# EAGLE design motor-control (EAGLE 6.2)
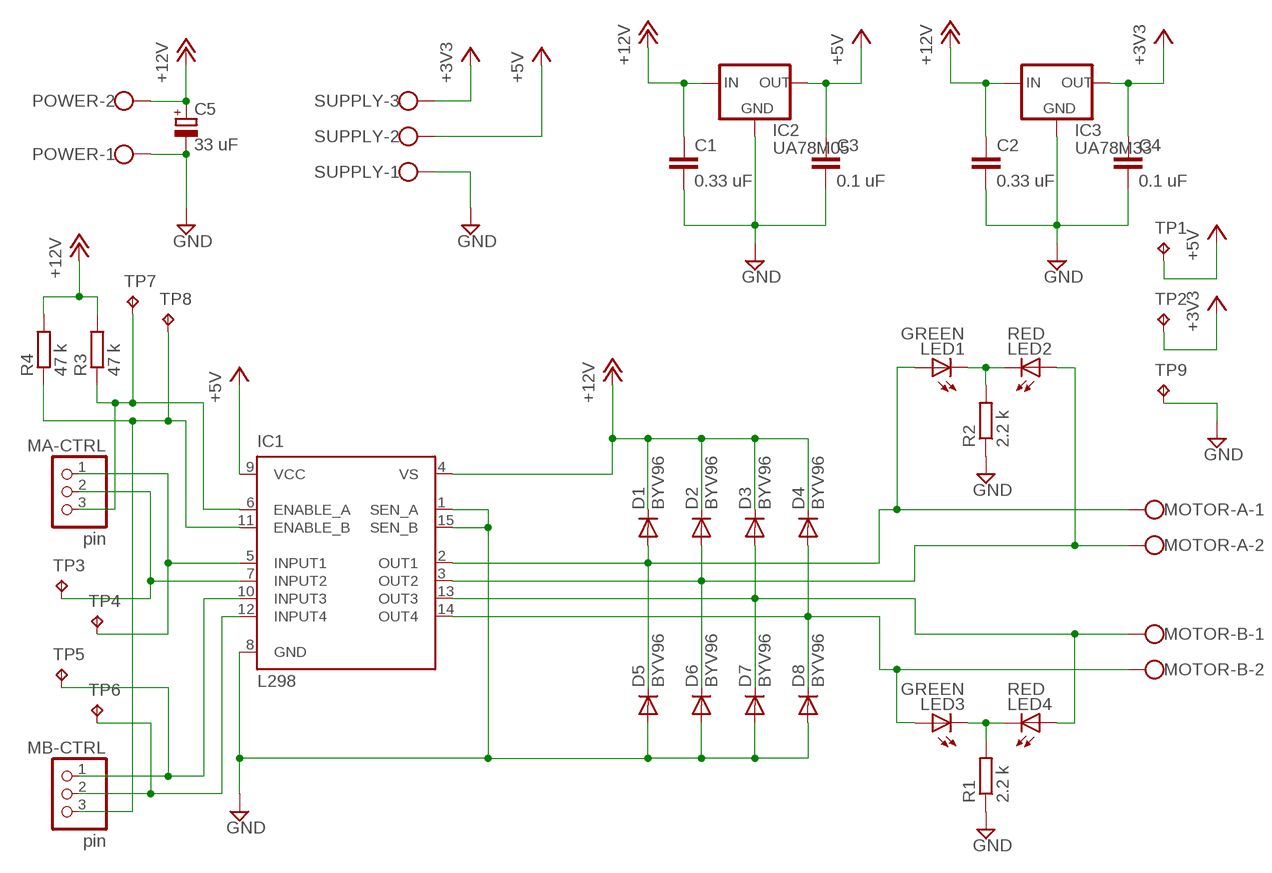
[diagram p0: schematic, sheet 1]

## Parts
C1  0.33 uF  C-EU050-024X044  [C050-024X044]
C2  0.33 uF  C-EU050-024X044  [C050-024X044]
C3  0.1 uF  C-EU050-024X044  [C050-024X044]
C4  0.1 uF  C-EU050-024X044  [C050-024X044]
C5  33 uF  CPOL-EUE2.5-5  [E2,5-5]
D1  BYV96  [SOD57-10]
D2  BYV96  [SOD57-10]
D3  BYV96  [SOD57-10]
D4  BYV96  [SOD57-10]
D5  BYV96  [SOD57-10]
D6  BYV96  [SOD57-10]
D7  BYV96  [SOD57-10]
D8  BYV96  [SOD57-10]
IC1  L298  [MULTIWATT-15]
IC2  UA78M05  78XXS  [78XXS]
IC3  UA78M33  78XXS  [78XXS]
LED1  GREEN  LED5MM  [LED5MM]
LED2  RED  LED5MM  [LED5MM]
LED3  GREEN  LED5MM  [LED5MM]
LED4  RED  LED5MM  [LED5MM]
MA-CTRL  pin  PINHD-1X3  [1X03]
MB-CTRL  pin  PINHD-1X3  [1X03]
MOTOR-A  W237-02P  [W237-132]
MOTOR-B  W237-02P  [W237-132]
POWER  W237-02P  [W237-132]
R1  2.2 k  R-EU_0207/7  [0207/7]
R2  2.2 k  R-EU_0207/7  [0207/7]
R3  47 k  R-EU_0207/7  [0207/7]
R4  47 k  R-EU_0207/7  [0207/7]
SUPPLY  W237-03P  [W237-133]
TP1  TPTP14SQ  [TP14SQ]
TP2  TPTP14SQ  [TP14SQ]
TP3  TPTP14SQ  [TP14SQ]
TP4  TPTP14SQ  [TP14SQ]
TP5  TPTP14SQ  [TP14SQ]
TP6  TPTP14SQ  [TP14SQ]
TP7  TPTP14SQ  [TP14SQ]
TP8  TPTP14SQ  [TP14SQ]
TP9  TPTP14SQ  [TP14SQ]

## Nets
+3V3: C4.1 IC3.OUT SUPPLY.3 TP2.TP
+5V: C3.1 IC1.9(VCC) IC2.OUT SUPPLY.2 TP1.TP
+12V: C1.1 C2.1 C5.+ D1.C D2.C D3.C D4.C IC1.4(VS) IC2.IN IC3.IN POWER.2 R3.2 R4.2
GND: C1.2 C2.2 C3.2 C4.2 C5.- D5.A D6.A D7.A D8.A IC1.1(SEN_A) IC1.8(GND) IC1.15(SEN_B) IC2.GND IC3.GND POWER.1 R1.1 R2.1 SUPPLY.1 TP9.TP
N$1: D1.A D5.C IC1.2(OUT1) LED1.A MOTOR-A.1
N$2: LED3.K(C) LED4.K(C) R1.2
N$3: LED1.K(C) LED2.K(C) R2.2
N$4: IC1.10(INPUT3) MB-CTRL.1 TP5.TP
N$5: IC1.12(INPUT4) MB-CTRL.2 TP6.TP
N$8: D4.A D8.C IC1.14(OUT4) LED3.A MOTOR-B.2
N$10: IC1.5(INPUT1) MA-CTRL.1 TP4.TP
N$11: IC1.7(INPUT2) MA-CTRL.2 TP3.TP
N$12: IC1.6(ENABLE_A) MA-CTRL.3 R3.1 TP7.TP
N$13: IC1.11(ENABLE_B) MB-CTRL.3 R4.1 TP8.TP
N$14: D2.A D6.C IC1.3(OUT2) LED2.A MOTOR-A.2
N$15: D3.A D7.C IC1.13(OUT3) LED4.A MOTOR-B.1

## Library data of the parts
C1-C4 = rcl:C-EU: CAPACITOR, European symbol
C5 = resistor:CPOL-EU: POLARIZED CAPACITOR, European symbol
D1-D8 = diode:BYV96: DIODE fast soft-recovery controlled avalanche rectifier
IC1 = st-microelectronics:L298: DUAL FULL-BRIDGE DRIVER
IC2 IC3 = v-reg:78XXS: VOLTAGE REGULATOR
LED1-LED4 = led:LED: LED OSRAM: - CHIPLED LG R971, LG N971, LY N971, LG Q971, LY Q971, LO R971, LY R971 LH N974, LH R974 LS Q976, LO Q976, LY Q976 LO Q996 - Hyper CHIPLED LW Q18S LB Q993, LB Q99A, LB R99A - SideLED LS A670, LO A670, LY A670, LG A670, LP A670 LB A673, LV A673, LT A673, LW A673 LH A674 LY A675 LS A676, LA A676, LO A676, LY A676, LW A676 LS A679, LY A679, LG A679 - Hyper Micro SIDELED® LS Y876, LA Y876, LO Y876, LY Y876 LT Y87S - SmartLED LW L88C, LW L88S LB L89C, LB L89S, LG L890 LS L89K, LO L89K, LY L89K LS L896, LA L896, LO L896, LY L896 - TOPLED LS T670, LO T670, LY T670, LG T670, LP T670 LSG T670, LSP T670, LSY T670, LOP T670, LYG T670 LG T671, LOG T671, LSG T671 LB T673, LV T673, LT T673, LW T673 LH T674 LS T676, LA T676, LO T676, LY T676, LB T676, LH T676, LSB T676, LW T676 LB T67C, LV T67C, LT T67C, LS T67K, LO T67K, LY T67K, LW E67C LS E67B, LA E67B, LO E67B, LY E67B, LB E67C, LV E67C, LT E67C LW T67C LS T679, LY T679, LG T679 LS T770, LO T770, LY T770, LG T770, LP T770 LB T773, LV T773, LT T773, LW T773 LH T774 LS E675, LA E675, LY E675, LS T675 LS T776, LA T776, LO T776, LY T776, LB T776 LHGB T686 LT T68C, LB T68C - Hyper Mini TOPLED® LB M676 - Mini TOPLED Santana® LG M470 LS M47K, LO M47K, LY M47K Source: http://www.osram.convergy.de LUXEON: - LUMILED® LXK2-PW12-R00, LXK2-PW12-S00, LXK2-PW14-U00, LXK2-PW14-V00 LXK2-PM12-R00, LXK2-PM12-S00, LXK2-PM14-U00 LXK2-PE12-Q00, LXK2-PE12-R00, LXK2-PE12-S00, LXK2-PE14-T00, LXK2-PE14-U00 LXK2-PB12-K00, LXK2-PB12-L00, LXK2-PB12-M00, LXK2-PB14-N00, LXK2-PB14-P00, LXK2-PB14-Q00 LXK2-PR12-L00, LXK2-PR12-M00, LXK2-PR14-Q00, LXK2-PR14-R00 LXK2-PD12-Q00, LXK2-PD12-R00, LXK2-PD12-S00 LXK2-PH12-R00, LXK2-PH12-S00 LXK2-PL12-P00, LXK2-PL12-Q00, LXK2-PL12-R00 Source: www.luxeon.com KINGBRIGHT: KA-3528ASYC Source: www.kingbright.com
MA-CTRL MB-CTRL = pinhead:PINHD-1X3: PIN HEADER
MOTOR-A MOTOR-B POWER = con-wago-508:W237-02P: WAGO SREW CLAMP
R1-R4 = resistor:R-EU_: RESISTOR, European symbol
SUPPLY = con-wago-508:W237-03P: WAGO SREW CLAMP
TP1-TP9 = testpad:TP: Test pad

## Board
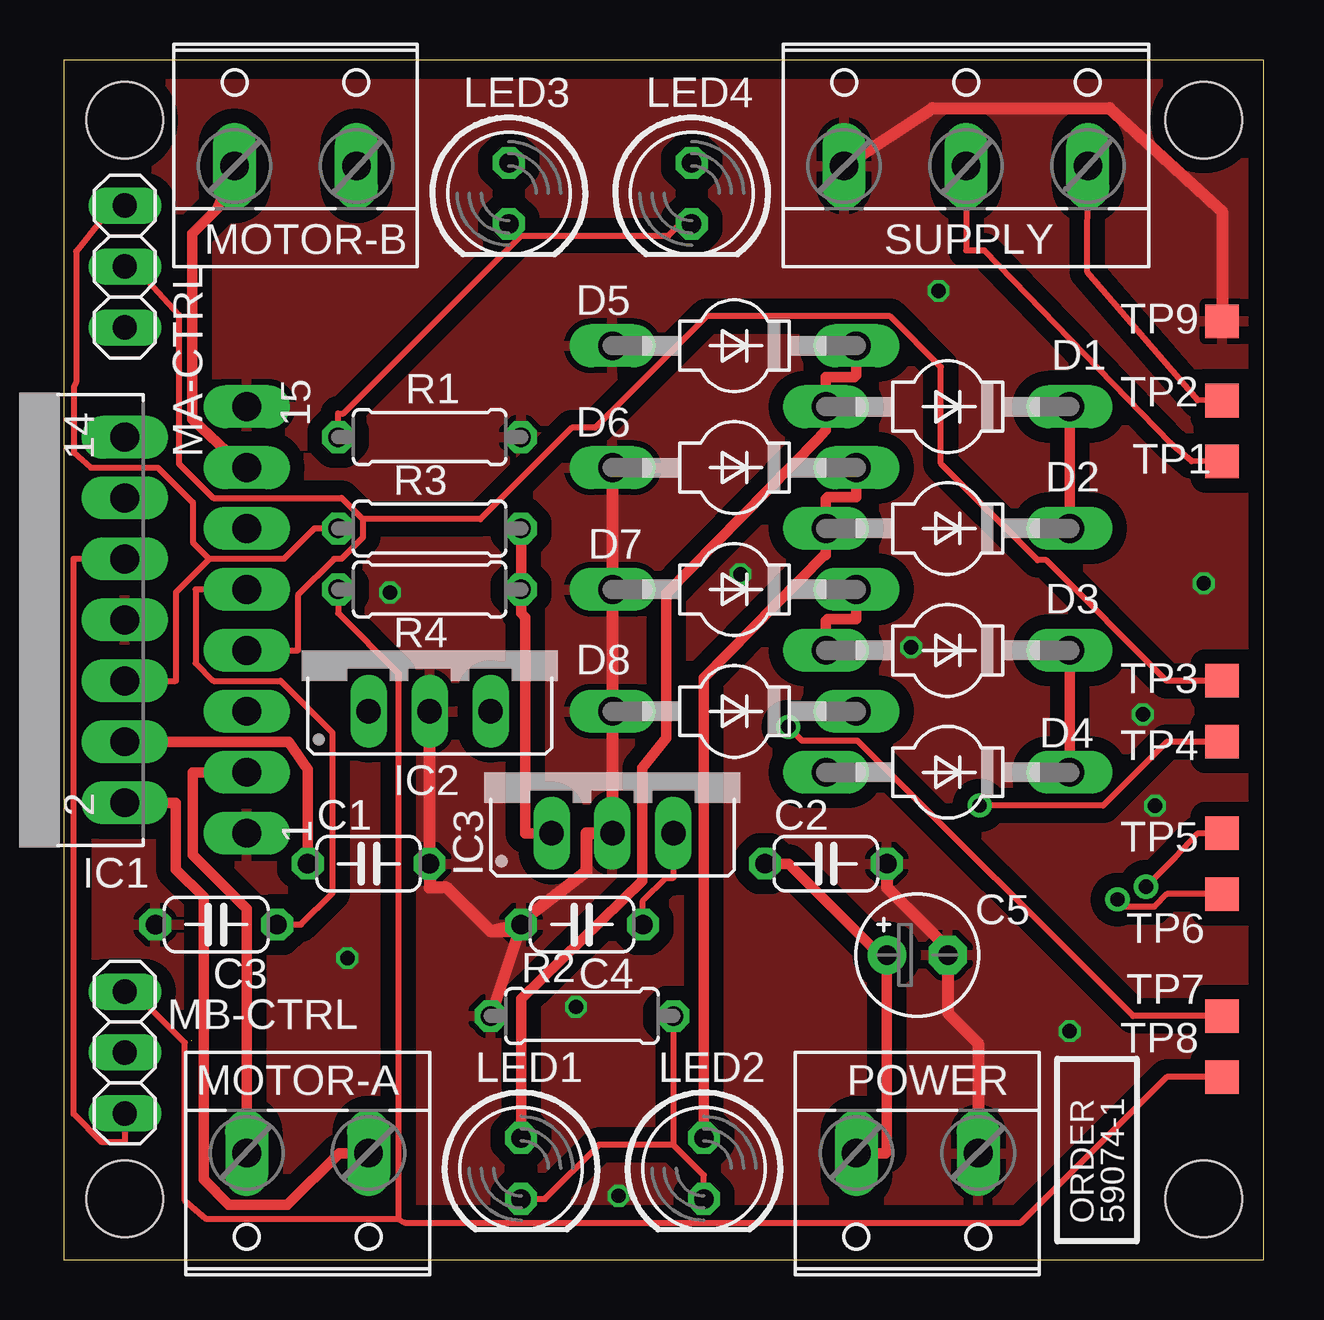
[diagram p1: board, top side]
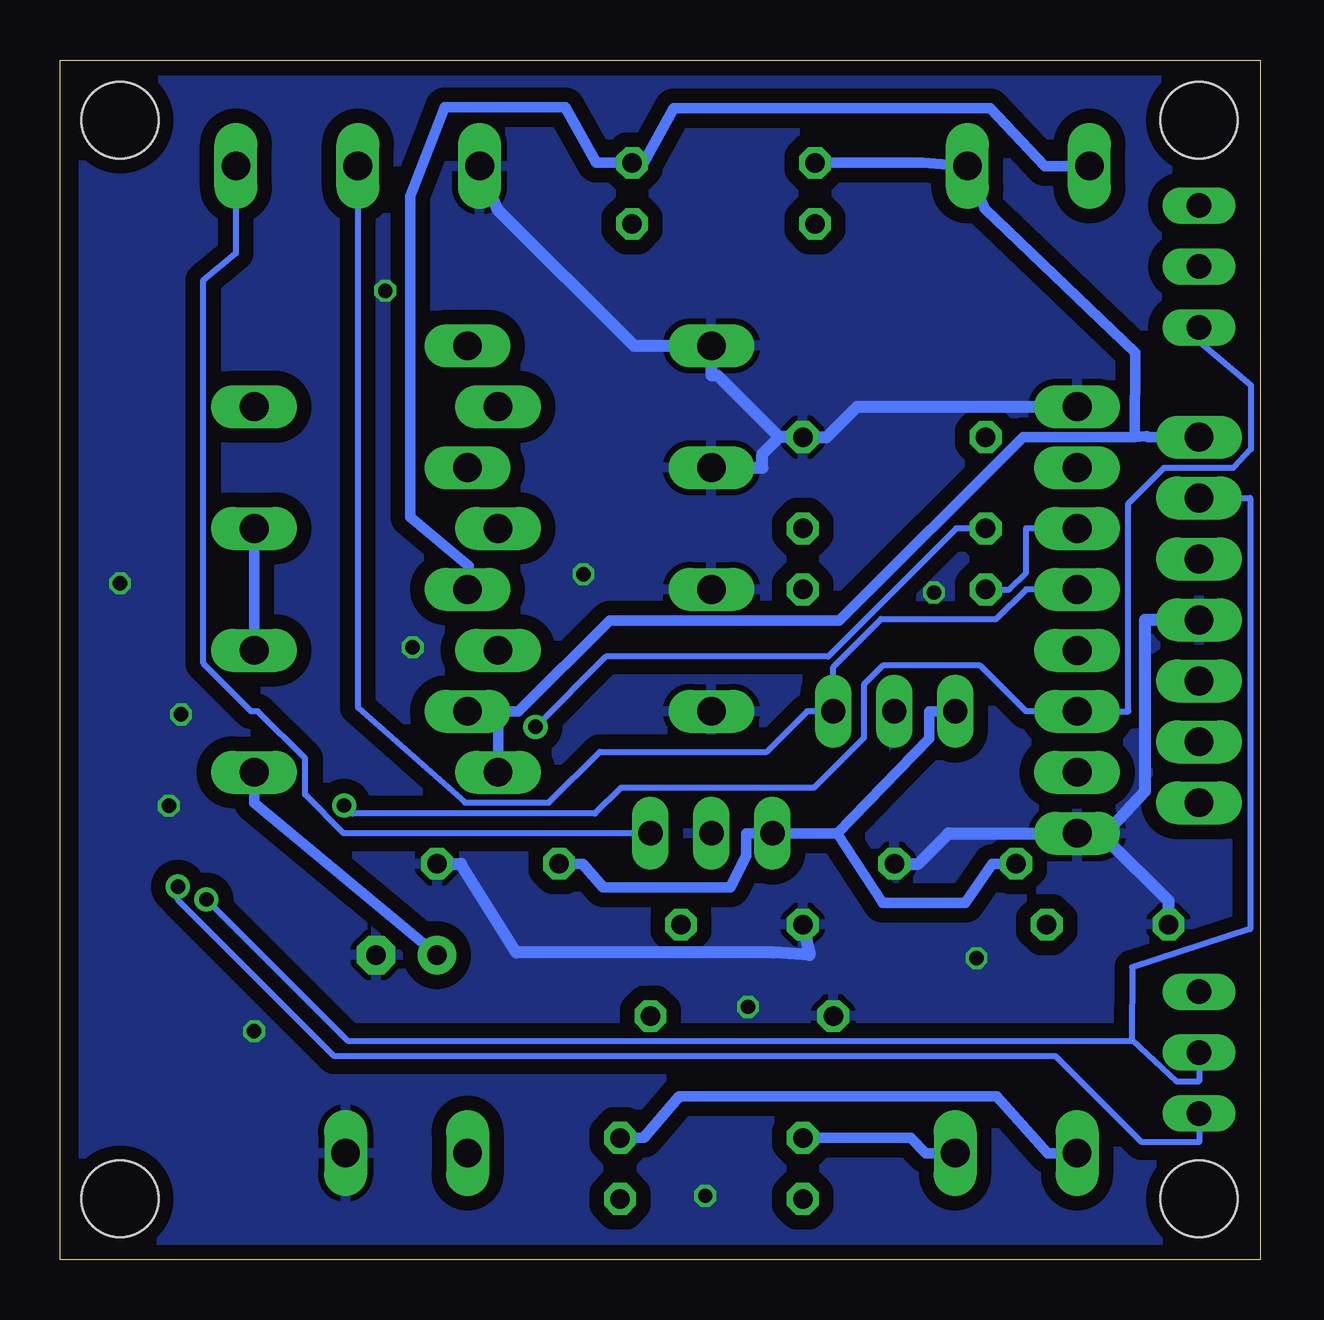
[diagram p2: board, bottom side, seen from below]

Size 50 x 50.01 mm. Coordinates in mm from the lower left corner, seen from the top.
Outline: 0,0 50,0 50,50.01 0,50.01 0,0
Copper layers (1*16): Top 0.035mm / dielectric 1.5mm / Bottom 0.035mm
Design rules: minimum track width 6mil, minimum drill 12mil, track to track 6mil, track to pad 6mil, pad to pad 6mil, via to via 6mil, smd to smd 0mil, copper to edge 10mil, drill to drill 10mil, minimum pad ring 10mil, minimum via ring 6mil, stop-mask expansion 2mil, vias tented up to drill 100mil, thermal gap 10mil
Holes 3.2 mm at 2.54,47.5 2.54,2.54 47.5,47.5 47.5,2.54

### Footprints (pad centres in the part's own frame; a part is rotated, then mirrored left to right if it is on the bottom)
C050-024X044 = drill 0.813 octagon: 1 -2.54,0; 2 2.54,0
E2,5-5 = drill 0.813 pad 1.6: + -1.27,0 | drill 0.813 pad 1.6 octagon: - 1.27,0
SOD57-10 = drill 1.194 long: A 5.08,0; C -5.08,0
MULTIWATT-15 = drill 1.2 long: 1 -8.89,-7.62; 2 -7.62,-2.54; 3 -6.35,-7.62; 4 -5.08,-2.54; 5 -3.81,-7.62; 6 -2.54,-2.54; 7 -1.27,-7.62; 8 0,-2.54; 9 1.27,-7.62; 10 2.54,-2.54; 11 3.81,-7.62; 12 5.08,-2.54; 13 6.35,-7.62; 14 7.62,-2.54; 15 8.89,-7.62
78XXS = drill 1.016 long: GND 0,-2.54; IN -2.54,-2.54; OUT 2.54,-2.54
LED5MM = drill 0.813 octagon: A -1.27,0; K 1.27,0
1X03 = drill 1.016 long: 1 -2.54,0; 2 0,0; 3 2.54,0
W237-132 = drill 1.194 long: 1 -2.54,-0.635; 2 2.54,-0.635
0207/7 = drill 0.813 octagon: 1 -3.81,0; 2 3.81,0
W237-133 = drill 1.194 long: 1 -5.08,-0.635; 2 0,-0.635; 3 5.08,-0.635
TP14SQ = smd 1.4 x 1.4: TP 0,0

### Placement (x,y rotation side)
C1  12.7,16.51 0 top
C2  31.75,16.51 0 top
C3  6.35,13.97 180 top
C4  21.59,13.97 180 top
C5  35.56,12.7 0 top
D1  36.83,35.56 180 top
D2  36.83,30.48 180 top
D3  36.83,25.4 180 top
D4  36.83,20.32 180 top
D5  27.94,38.1 180 top
D6  27.94,33.02 180 top
D7  27.94,27.94 180 top
D8  27.94,22.86 180 top
IC1  0,26.67 90 top
IC2  15.24,25.4 0 top
IC3  22.86,20.32 0 top
LED1  19.05,3.81 270 top
LED2  26.67,3.81 270 top
LED3  18.54,44.45 270 top
LED4  26.16,44.45 270 top
MA-CTRL  2.54,41.4 90 top
MB-CTRL  2.54,8.64 90 top
MOTOR-A  10.16,3.81 180 top
MOTOR-B  9.65,46.23 0 top
POWER  35.56,3.81 180 top
R1  15.24,34.29 180 top
R2  21.59,10.16 0 top
R3  15.24,30.48 0 top
R4  15.24,27.94 0 top
SUPPLY  37.59,46.23 0 top
TP1  48.26,33.27 0 top
TP2  48.26,35.81 0 top
TP3  48.26,24.13 0 top
TP4  48.26,21.59 0 top
TP5  48.26,17.78 0 top
TP6  48.26,15.24 0 top
TP7  48.26,10.16 0 top
TP8  48.26,7.62 0 top
TP9  48.26,39.12 0 top

### Tracks (layer width: path | path; a pad name or v marks a point on that pad's centre or on a via)
+3V3
  Top 0.254: IC3.OUT 25.4,15.93 25.09,15.93 24.13,14.96 C4.1 | TP2.TP 47.24,35.83 42.65,41.17 SUPPLY.3
  Bottom 0.254: IC3.OUT 38.18,17.78 39.79,19.39 39.79,20.9 41.75,22.86 42.03,22.86 44.03,24.86 44.03,40.84 42.67,41.95 SUPPLY.3
+5V
  Top 0.254: C3.1 9.88,13.97 11.19,15.28 11.19,21.97 9.03,24.13 6.23,24.13 5.49,24.87 5.49,27.94 IC1.9 | TP1.TP 46.99,33.29 46.11,34.05 38.35,42.06 37.59,42.06 SUPPLY.2
  Bottom 0.254: SUPPLY.2 37.59,23.02 33.12,19.05 29.63,19.05 27.51,21.17 20.56,21.17 18.87,22.86 IC2.OUT 17.78,24.71 15.79,26.71 10.98,26.71 9.75,27.94 IC1.9
+12V
  Top 0.432: C1.1 10.16,20.43 9.38,21.59 IC1.4 | C2.1 30.2,16.51 34.29,12.42 C5.+ 34.29,4.49 34.25,4.45 POWER.2 | D4.C D3.C | D2.C D1.C | IC3.IN 19.23,17.78 19.23,26.77 19.05,26.95 R4.2 R3.2
  Bottom 0.432: C5.+ 41.91,19.05 D4.C | 17.62,17.78 IC3.IN 21.41,17.78 21.41,16.82 22.07,15.53 27.37,15.53 28.22,16.51 C2.1 | 17.62,17.78 13.79,21.73 13.79,22.86 IC2.IN | 17.62,17.78 15.73,14.88 12.28,14.88 11.15,16.51 C1.1 | D3.C D2.C
GND  (via drill 0.6)
  Top 0.508: 17.78,13.69 15.95,15.52 15.24,15.52 C1.2 IC2.GND | 17.78,13.69 18.54,13.69 21.77,16.16 21.77,17.78 IC3.GND D8.A D7.A D6.A | 17.78,13.69 C4.2 R2.1 | C2.2 34.29,15.52 36.83,12.98 C5.- 36.83,10.3 38.1,9.03 POWER.1 | SUPPLY.1 36.2,48.01 43.56,48.01 48.26,43.69 TP9.TP
  Bottom 0.508: C1.2 14.25,16.51 12.98,17.78 IC1.1 6.42,17.78 | C2.2 33.3,16.51 30.99,12.8 20.27,12.8 18.77,12.7 C4.2 | 6.42,17.78 6.42,17.57 3.81,14.96 C3.2 | 6.42,17.78 4.8,19.53 4.8,26.67 IC1.8 | 20.04,34.29 22.62,36.87 22.86,36.87 D5.A 26.08,38.1 31.79,43.81 SUPPLY.1 | 20.04,34.29 20.74,33.59 20.74,33.02 D6.A | 20.04,34.29 R1.1 18.06,34.29 16.79,35.56 IC1.15
  other vias: 36.45,40.39 21.34,10.54 11.81,12.57 35.31,25.53 47.5,28.19 45.47,18.92 44.96,22.73 41.91,9.53 23.11,2.67 28.19,28.57 13.59,27.81
  pour Bottom (isolate 0.61): 0.38,49.15 49.02,49.15 49.02,0.51 0.38,0.51
  pour Top (isolate 0.61): 0.25,49.02 49.15,49.02 49.15,0.38 0.25,0.38
N$1
  Top 0.432: LED1.A 19.05,10.87 24.09,15.79 24.09,20.49 25.11,21.76 25.11,27.77 31.42,34.21 31.75,34.59 D1.A 31.75,36.79 32.93,36.79 33.02,36.87 D5.C | MOTOR-A.1 11.47,4.45 9.31,2.29 6.88,2.29 5.82,3.35 5.82,15.12 4.67,16.27 4.67,19.05 IC1.2
  Bottom 0.432: MOTOR-A.1 13.93,4.45 14.56,5.08 LED1.A
N$2
  Top 0.254: R1.2 11.43,35.28 11.65,35.28 19.05,42.69 | LED4.K 25.68,43.18 25.18,42.69 19.05,42.69 | LED3.K 19.05,42.69
N$3
  Top 0.254: 25.4,4.8 26.67,3.53 LED2.K | R2.2 25.4,4.8 | 25.4,4.8 22.3,4.8 20.04,2.54 LED1.K
N$4  (via drill 0.6 pad 1.01)
  Top 0.254: v45.09,15.55 46.29,16.75 47.24,17.77 TP5.TP | IC1.10 0.41,29.21 0.41,6.08 1.58,4.9 2.54,4.9 MB-CTRL.1
  Bottom 0.254: v45.09,15.55 45.09,15 38.57,8.49 8.51,8.49 4.93,4.9 2.54,4.9 MB-CTRL.1
N$5  (via drill 0.6 pad 1.01)  (1 unrouted)
  Top 0.254: TP6.TP 45.96,15.24 45.44,14.72 44.2,14.72 v43.9,15.02
  Bottom 0.254: 5.32,9.13 5.35,9.14 5.33,12.19 0.41,13.79 0.41,31.75 IC1.12 | 5.32,9.13 3.5,7.44 2.54,7.44 MB-CTRL.2 | v43.9,15.02 38.02,9.13 5.32,9.13
N$8
  Bottom 0.432: 31.96,22.86 31.75,22.65 D4.A | 31.96,22.86 30.9,22.86 27.1,26.66 17.53,26.66 9.87,34.29 5.22,34.29 | D8.C 31.96,22.86 | 5.22,34.29 4.71,34.33 4.67,34.29 IC1.14 | 5.22,34.29 5.21,37.8 11.47,43.81 MOTOR-B.2 14.05,45.72 LED3.A
N$10  (via drill 0.6 pad 1.01)
  Top 0.254: TP4.TP 45.96,21.59 43.3,18.93 v38.16,18.93
  Bottom 0.254: v38.16,18.93 37.82,18.59 27.71,18.59 26.63,19.67 18.6,19.67 16.51,21.76 16.51,23.98 15.72,24.77 11.66,24.77 9.75,22.86 IC1.5 5.49,22.86 5.49,31.52 3.99,33.02 1.1,33.02 0.38,33.78 0.38,36.45 2.54,38.28 MA-CTRL.1
N$11
  Top 0.254: TP3.TP 45.96,24.13 40.92,29.17 40.57,29.17 36.54,33.2 36.54,37.21 34.43,39.33 26.78,39.33 22.14,34.68 21.17,34.68 17.35,30.86 12.46,30.86 | MA-CTRL.2 2.54,40.82 3.5,40.82 4.79,39.39 4.79,33.18 6.22,31.75 11.57,31.75 12.46,30.86 | 12.46,30.86 12.46,30.11 11.56,29.21 11.26,29.21 9.75,27.7 9.75,25.4 IC1.7
N$12  (via drill 0.6 pad 1.01)
  Top 0.254: 6.07,29.21 4.67,27.81 4.67,24.13 IC1.6 | 6.07,29.21 9.17,29.21 10.44,30.48 R3.1 | 6.07,29.21 5.37,29.9 5.37,31.56 3.92,33.02 1.12,33.02 0.42,33.64 0.42,35.43 0.42,36.35 0.51,36.58 0.51,42.03 1.58,43.36 2.54,43.36 MA-CTRL.3 | TP7.TP 44.55,10.16 33.08,21.63 30.77,21.63 v30.19,22.21
  Bottom 0.254: R3.1 12.66,30.48 18,25.14 27.26,25.14 v30.19,22.21
N$13
  Top 0.254: 13.94,1.69 14.21,1.54 39.88,1.54 45.96,7.62 TP8.TP | 13.94,1.69 13.94,24.44 11.43,26.95 R4.1 | 13.94,1.69 5.94,1.69 5.04,2.46 5.04,9.05 3.5,10.59 2.79,10.59 MB-CTRL.3
  Bottom 0.254: IC1.11 9.75,30.48 9.75,28.63 10.44,27.94 R4.1
N$14
  Top 0.432: IC1.3 5.36,20.32 5.36,16.87 7.62,14.62 MOTOR-A.2 | LED2.A 26.67,6.07 26.67,24.25 31.67,29.38 31.75,29.38 D2.A 31.75,31.71 31.84,31.79 33.02,31.79 D6.C
  Bottom 0.432: LED2.A 25.68,5.08 24.19,6.82 10.97,6.82 8.85,4.45 MOTOR-A.2
N$15
  Top 0.432: MOTOR-B.1 6.39,43.81 5.35,42.77 5.35,35.04 7.5,33.02 IC1.13 | D7.C 33.02,26.71 31.84,26.71 31.75,26.63 D3.A
  Bottom 0.432: MOTOR-B.1 8.97,45.59 11.25,48 24.42,48 25.68,45.72 LED4.A 27.66,45.72 28.96,48.03 33.98,48.03 35.4,44.33 35.4,30.96 32.97,28.91 33.02,28.66 D7.C

### Text on the board
tNames: ORDER | 59074-1